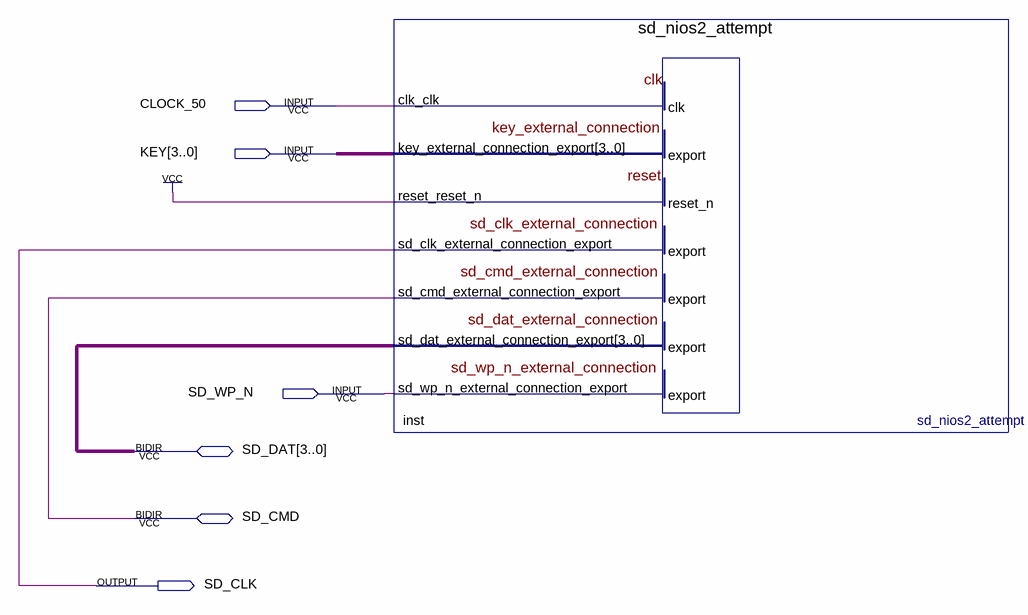
[diagram p0: schematic sheet]
// Quartus schematic top.bdf as structural Verilog: 1 symbols, 6 pins
module top (
  input  CLOCK_50,
  input  [3:0] KEY,
  input  SD_WP_N,
  inout  [3:0] SD_DAT,
  inout  SD_CMD,
  output SD_CLK
);

  sd_nios2_attempt inst (
    .clk_clk(CLOCK_50), .key_external_connection_export(KEY), .reset_reset_n(1'b1),
    .sd_wp_n_external_connection_export(SD_WP_N), .sd_clk_external_connection_export(SD_CLK),
    .sd_cmd_external_connection_export(SD_CMD), .sd_dat_external_connection_export(SD_DAT));
endmodule
